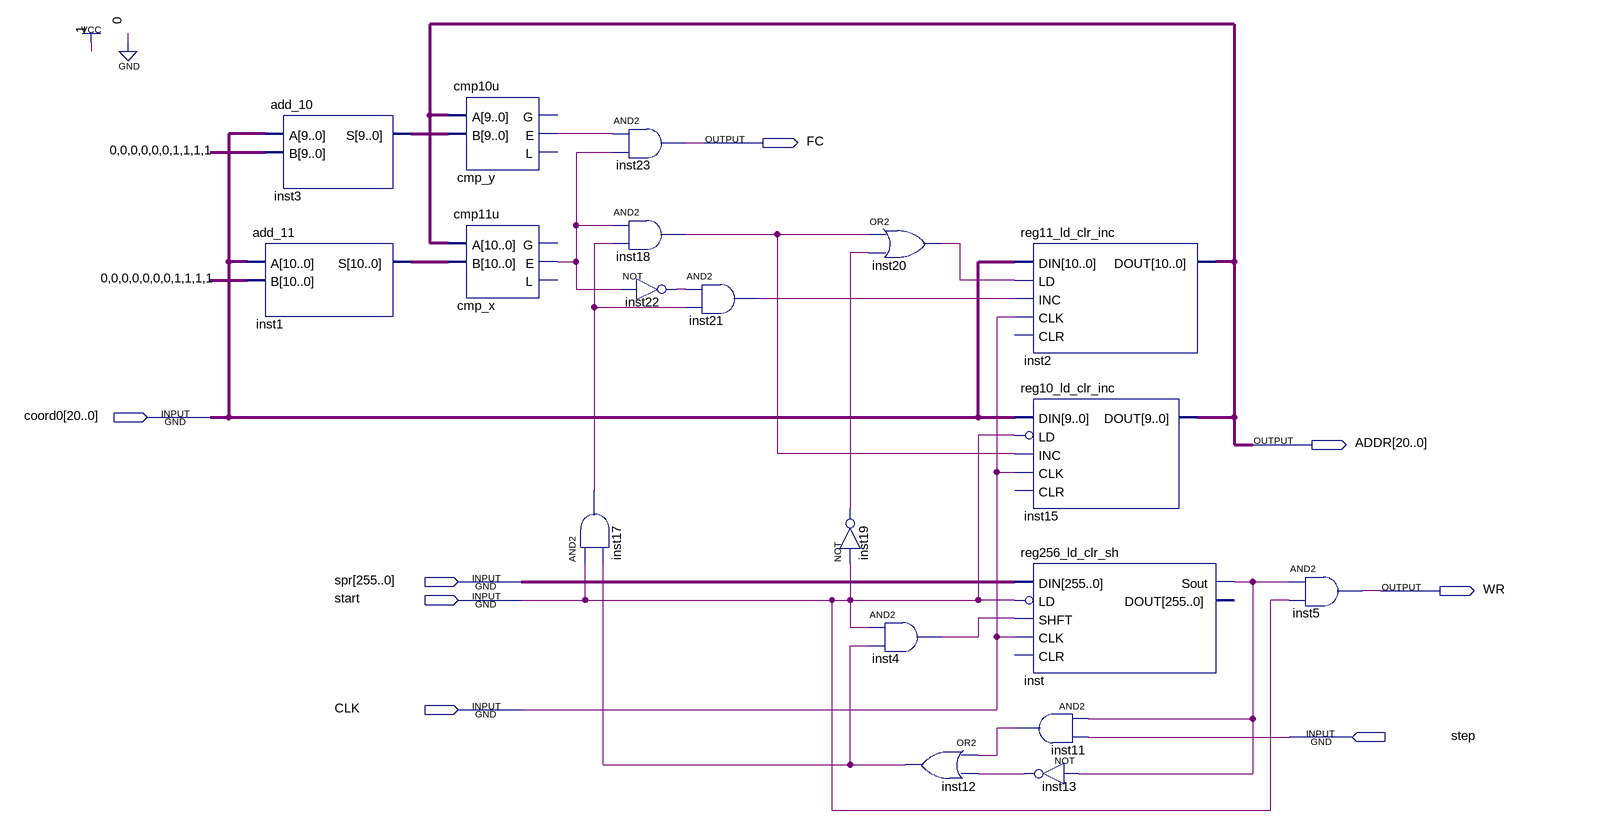
[diagram p0: schematic sheet]
// Quartus schematic gca_dspr.bdf as structural Verilog: 19 symbols, 8 pins
module gca_dspr (
  input  [20:0] coord0,
  input  [255:0] spr,
  input  start,
  input  CLK,
  input  step,
  output FC,
  output [20:0] ADDR,
  output WR
);

  wire cmp_x_e, cmp_y_e, inst4_out, inst11_out, inst12_out, inst13_out, inst17_out, inst18_out, inst19_out,
       inst20_out, inst21_out, inst22_out, inst_sout;
  wire [9:0] inst3_s;
  wire [10:0] inst1_s;

  add_10 inst3 (.A(coord0[20:11]), .B(10'b0000001111), .S(inst3_s));
  add_11 inst1 (.A(coord0[10:0]), .B(11'b00000001111), .S(inst1_s));
  cmp10u cmp_y (.A(ADDR[20:11]), .B(inst3_s), .E(cmp_y_e));  // open: G, L
  cmp11u cmp_x (.A(ADDR[10:0]), .B(inst1_s), .E(cmp_x_e));  // open: G, L
  and inst23 (FC, cmp_y_e, cmp_x_e);
  and inst18 (inst18_out, cmp_x_e, inst17_out);
  not inst22 (inst22_out, cmp_x_e);
  and inst17 (inst17_out, start, inst12_out);
  and inst21 (inst21_out, inst22_out, inst17_out);
  not inst19 (inst19_out, start);
  or inst20 (inst20_out, inst18_out, inst19_out);
  and inst4 (inst4_out, start, inst12_out);
  or inst12 (inst12_out, inst11_out, inst13_out);
  reg11_ld_clr_inc inst2 (
    .CLK(CLK), .DIN(coord0[10:0]), .INC(inst21_out), .LD(inst20_out), .DOUT(ADDR[10:0]));  // open: CLR
  reg10_ld_clr_inc inst15 (
    .CLK(CLK), .DIN(coord0[20:11]), .INC(inst18_out), .LD(~start), .DOUT(ADDR[20:11]));  // open: CLR
  reg256_ld_clr_sh inst (.CLK(CLK), .DIN(spr), .LD(~start), .SHFT(inst4_out), .Sout(inst_sout));  // open: CLR, DOUT
  and inst11 (inst11_out, inst_sout, step);
  not inst13 (inst13_out, inst_sout);
  and inst5 (WR, inst_sout, start);

  // Other names for the same wires on the sheet: coord_i[9:0] = coord0[20:11]; coord_j[10:0] = coord0[10:0];
  //   x[10:0] = ADDR[10:0]; y[9:0] = ADDR[20:11]
endmodule
